# EasyEDA schematic SCH_Vertical-Carousel_2025-01-21.json
TITLE: Vertical_Carousel; REV: 1.0; Date: 2025-01-17; Sheet: 1/1; Company: Fabtronics
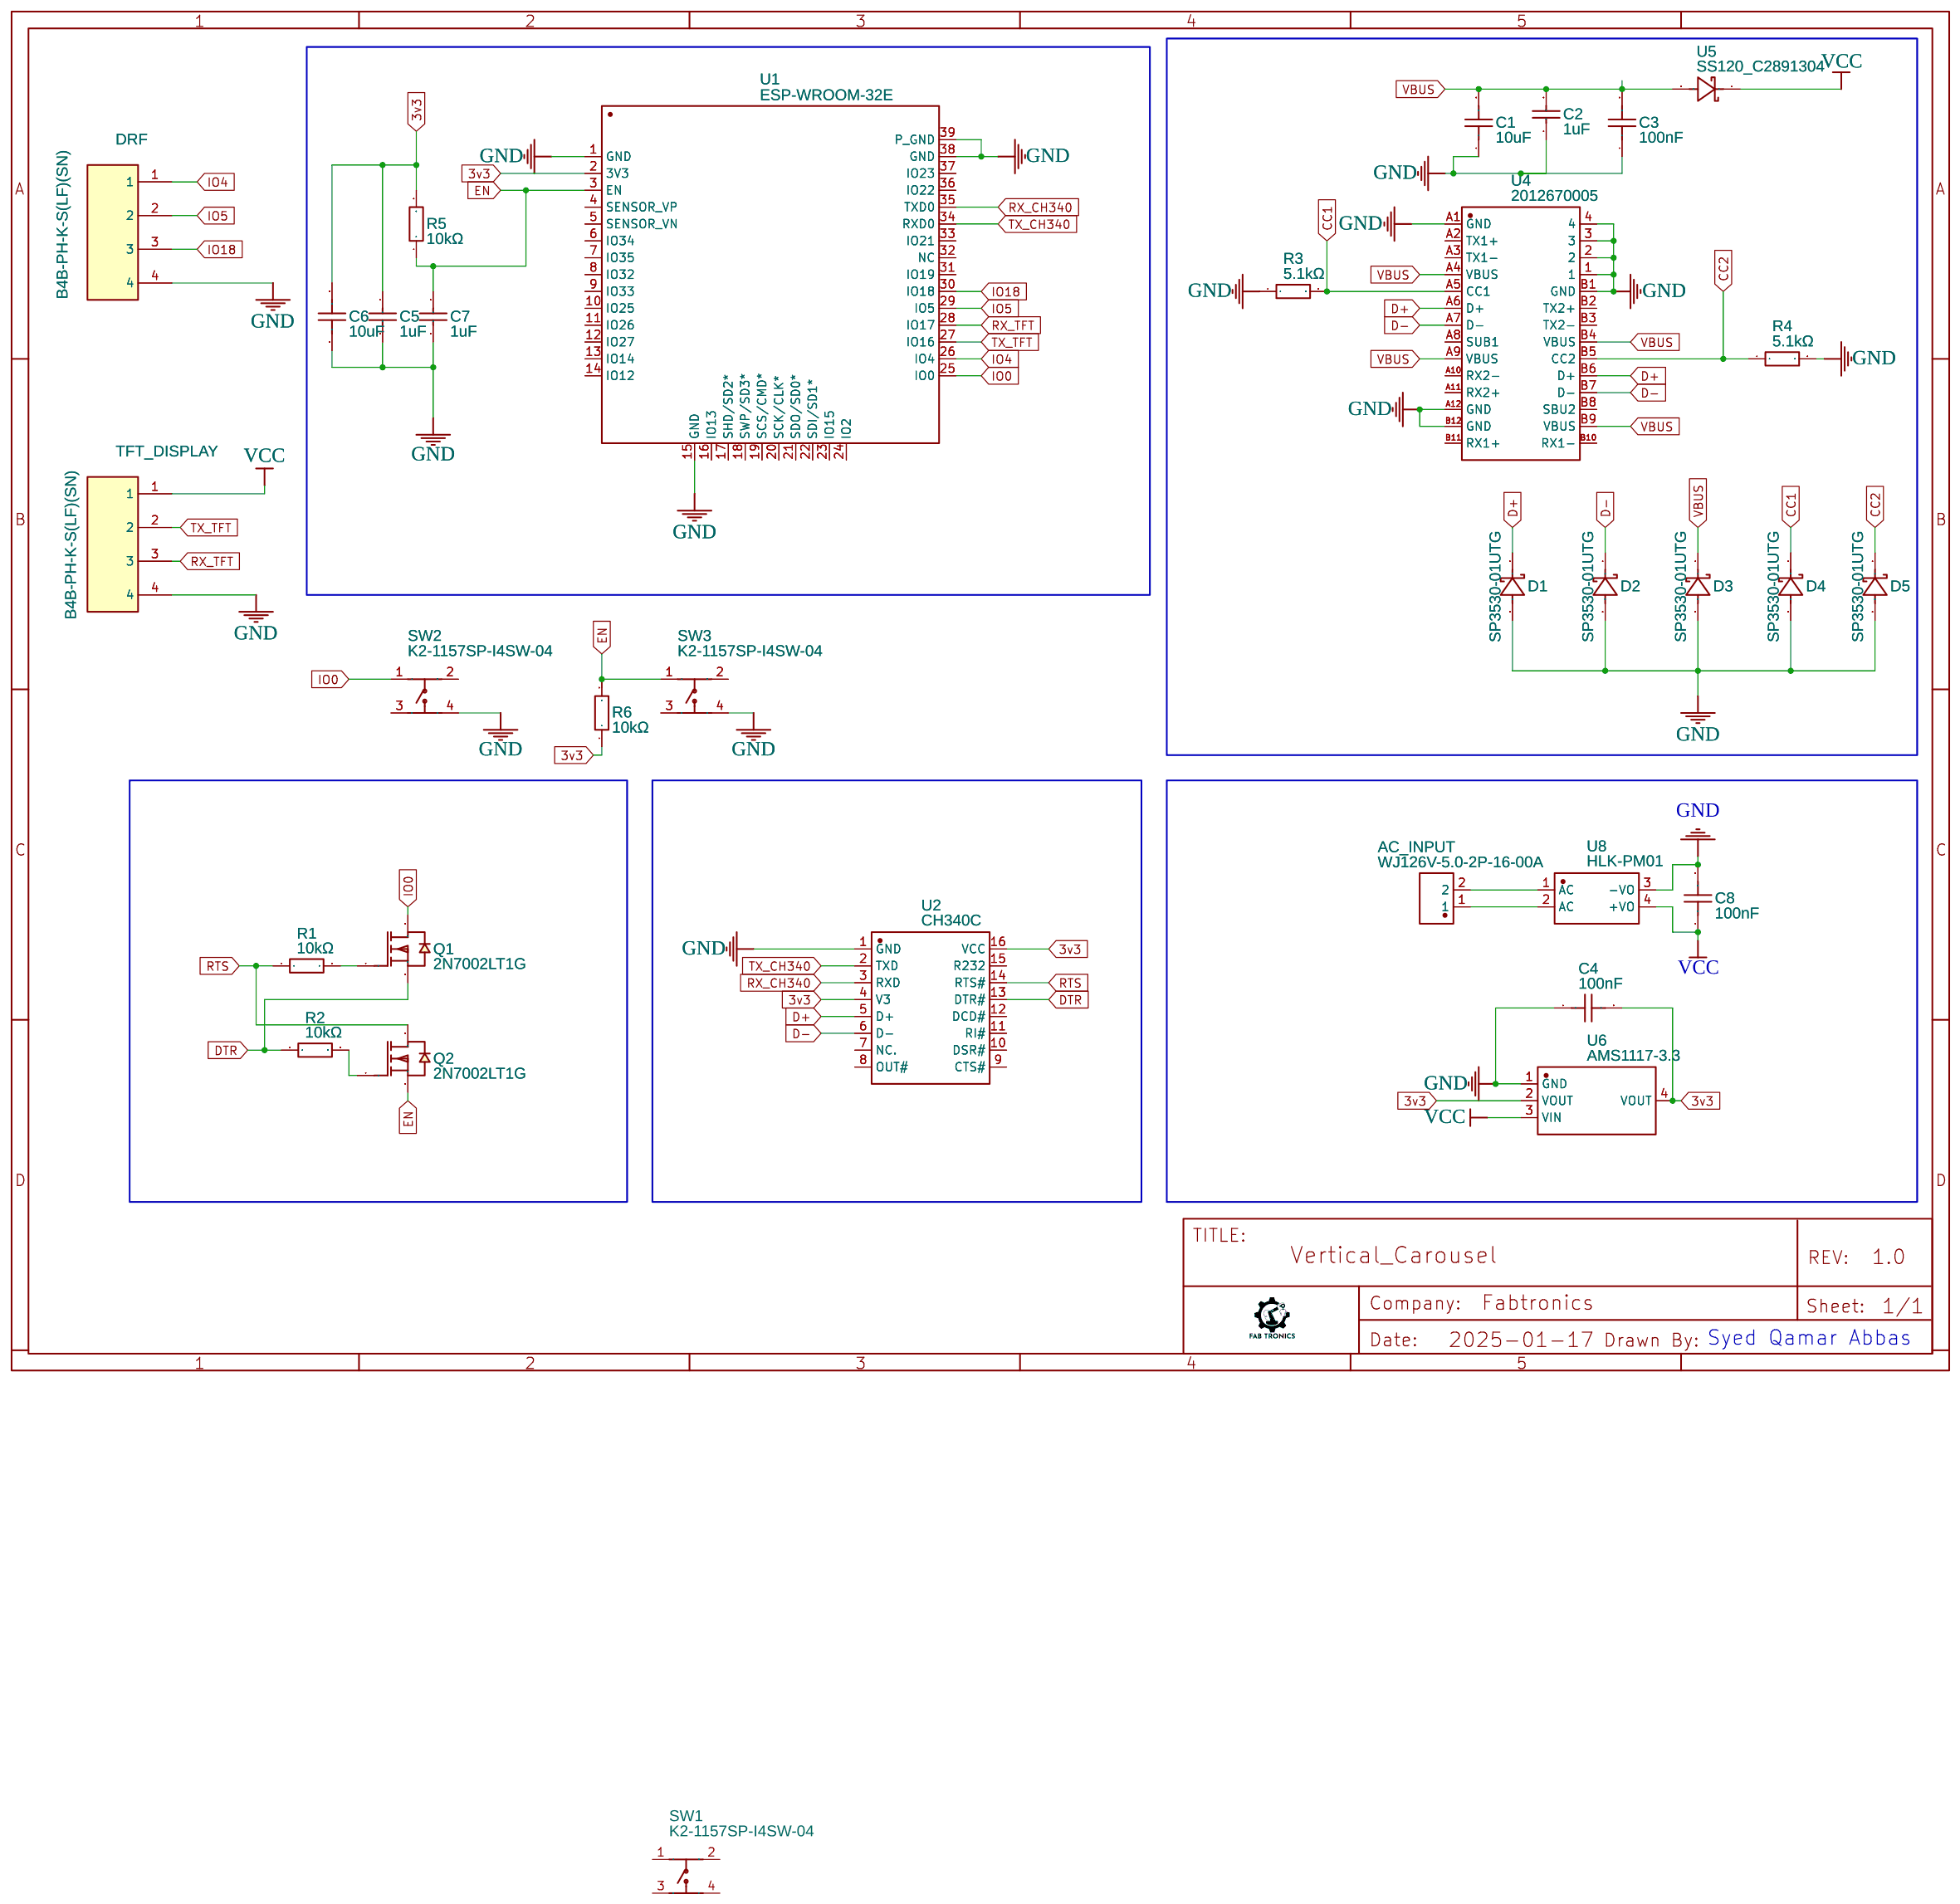
[diagram p0: schematic sheet]

## Parts
AC_INPUT  WJ126V-5.0-2P-16-00A  [CONN-TH_WJ126V-5.0-2P]
C1  10uF  [C0805]
C2  1uF  [C0805]
C3  100nF  [C0603]
C4  100nF  [C0603]
C5  1uF  [C0805]
C6  10uF  [C0805]
C7  1uF  [C0805]
C8  100nF  [C0603]
D1  SP3530-01UTG  [DFN0603-D_L0.6-W0.3-P0.34-RD]
D2  SP3530-01UTG  [DFN0603-D_L0.6-W0.3-P0.34-RD]
D3  SP3530-01UTG  [DFN0603-D_L0.6-W0.3-P0.34-RD]
D4  SP3530-01UTG  [DFN0603-D_L0.6-W0.3-P0.34-RD]
D5  SP3530-01UTG  [DFN0603-D_L0.6-W0.3-P0.34-RD]
DRF  B4B-PH-K-S(LF)(SN)  [CONN-TH_B4B-PH-K-S]
Q1  2N7002LT1G  [SOT-23_L2.9-W1.3-P1.90-LS2.4-BR]
Q2  2N7002LT1G  [SOT-23_L2.9-W1.3-P1.90-LS2.4-BR]
R1  10kΩ  [R0402]
R2  10kΩ  [R0402]
R3  5.1kΩ  [R0805]
R4  5.1kΩ  [R0805]
R5  10kΩ  [R0402]
R6  10kΩ  [R0402]
SW1  K2-1157SP-I4SW-04  [SW-SMD_4P-L6.2-W6.2-P4.50-LS8.6]
SW2  K2-1157SP-I4SW-04  [SW-SMD_4P-L6.2-W6.2-P4.50-LS8.6]
SW3  K2-1157SP-I4SW-04  [SW-SMD_4P-L6.2-W6.2-P4.50-LS8.6]
TFT_DISPLAY  B4B-PH-K-S(LF)(SN)  [CONN-TH_B4B-PH-K-S]
U1  ESP-WROOM-32E  [COMM-SMD_ESP-WROOM-32D]
U2  CH340C  [SOP-16_L10.0-W3.9-P1.27-LS6.0-BL]
U4  2012670005  [USB-C-SMD_2012670005]
U5  SS120_C2891304  [SMA_L4.5-W2.6-LS5.0-RD]
U6  AMS1117-3.3  [SOT-223-3_L6.5-W3.4-P2.30-LS7.0-BR]
U8  HLK-PM01  [PWRM-TH_HLK-PM01]

## Library data of the parts
AC_INPUT = WJ126V-5.0-2P-16-00A: Supplier: LCSC; Supplier Part: C3031437; Manufacturer: KANGNEX(康奈克斯电气); JLCPCB Part Class: Extended Part; Contributor: lcsc
C1 C6 = CL21A106KAYNNNE: Supplier: LCSC; Manufacturer: SAMSUNG(三星); Supplier Part: C15850; JLCPCB Part Class: Basic Part
C2 C5 C7 = CL21B105KBFNNNE: Supplier: LCSC; Manufacturer: SAMSUNG(三星); Supplier Part: C28323; JLCPCB Part Class: Basic Part
C3 C4 C8 = CC0603KRX7R9BB104: Supplier: LCSC; Manufacturer: YAGEO(国巨); Supplier Part: C14663; JLCPCB Part Class: Basic Part
D1-D5 = SP3530-01UTG: Contributor: LCSC; Supplier: LCSC; Supplier Part: C1973961; Manufacturer: Littelfuse(美国力特); JLCPCB Part Class: Extended Part
DRF TFT_DISPLAY = B4B-PH-K-S(LF)(SN): Contributor: LCSC; Supplier: LCSC; Manufacturer: JST; Supplier Part: C131334; JLCPCB Part Class: Extended Part
Q1 Q2 = 2N7002LT1G: Supplier: LCSC; Manufacturer: onsemi(安森美); Supplier Part: C16338; JLCPCB Part Class: Extended Part
R1 R2 R5 R6 = RC0402FR-0710KL: Supplier: LCSC; Manufacturer: YAGEO(国巨); Supplier Part: C60490; JLCPCB Part Class: Extended Part
R3 R4 = RS-05K512JT: Contributor: LCSC; Supplier: LCSC; Manufacturer: FH(风华); Supplier Part: C115337; JLCPCB Part Class: Extended Part
SW1-SW3 = K2-1157SP-I4SW-04: Contributor: LCSC; Supplier: LCSC; Supplier Part: C2909692; Manufacturer: 韩国韩荣; Manufacturer Part: K2-1157SP-I4SW-01; JLCPCB Part Class: Extended Part
U1 = ESP-WROOM-32E: Supplier: LCSC; Supplier Part: C19949066; Manufacturer: DOIT(四博智联); Contributor: lcsc; JLCPCB Part Class: Extended Part
U2 = CH340C: Supplier: LCSC; Manufacturer: WCH(南京沁恒); Supplier Part: C84681; JLCPCB Part Class: Extended Part
U4 = 2012670005: Contributor: LCSC; Supplier: LCSC; Supplier Part: C565324; Manufacturer: MOLEX; JLCPCB Part Class: Extended Part
U5 = SS120_C2891304: Contributor: lcsc; Supplier: LCSC; Supplier Part: C2891304; Manufacturer: GOODWORK(固得沃克); Manufacturer Part: SS120; JLCPCB Part Class: Extended Part
U6 = AMS1117-3.3: sourceId: dwIGgezVh; Supplier: LCSC; Manufacturer: AMS; Supplier Part: C6186; JLCPCB Part Class: Basic Part
U8 = HLK-PM01: Contributor: LCSC; Supplier: LCSC; Supplier Part: C209903; Manufacturer: HI-LINK(海凌科); JLCPCB Part Class: Extended Part

## Nets
3v3: C4.2 C5.2 C6.2 R5.2 R6.1 U1.2(3V3) U2.4(V3) U2.16(VCC) U6.2(VOUT) U6.4(VOUT)
GND: C1.1 C2.1 C3.1 C4.1 C5.1 C6.1 C7.1 C8.2 D1.2 D2.2 D3.2 D4.2 D5.2 DRF.4 R3.1 R4.2 SW2.4 SW3.4 TFT_DISPLAY.4 U1.1(GND) U1.15(GND) U1.38(GND) U1.39(P_GND) U2.1(GND) U4.1 U4.2 U4.3 U4.4 U4.A1(GND) U4.A12(GND) U4.B1(GND) U4.B12(GND) U6.1(GND) U8.3(-VO)
VBUS: C1.2 C2.2 C3.2 D3.1 U4.A4(VBUS) U4.A9(VBUS) U4.B4(VBUS) U4.B9(VBUS) U5.2(A)
VCC: C8.1 TFT_DISPLAY.1 U5.1(K) U6.3(VIN) U8.4(+VO)
CC1: D4.1 R3.2 U4.A5(CC1)
CC2: D5.1 R4.1 U4.B5(CC2)
D+: D1.1 U2.5(D+) U4.A6(D+) U4.B6(D+)
D-: D2.1 U2.6(D-) U4.A7(D-) U4.B7(D-)
DTR: Q1.2(S) R2.1 U2.13(DTR#)
EN: C7.2 Q2.2(S) R5.1 R6.2 SW3.1 U1.3(EN)
IO0: Q1.3(D) SW2.1 U1.25(IO0)
IO4: DRF.1 U1.26(IO4)
IO5: DRF.2 U1.29(IO5)
IO18: DRF.3 U1.30(IO18)
RTS: Q2.3(D) R1.1 U2.14(RTS#)
RX_CH340: U1.35(TXD0) U2.3(RXD)
RX_TFT: TFT_DISPLAY.3 U1.28(IO17)
TX_CH340: U1.34(RXD0) U2.2(TXD)
TX_TFT: TFT_DISPLAY.2 U1.27(IO16)
Net-(AC_INPUT-1): AC_INPUT.1 U8.2(AC)
Net-(AC_INPUT-2): AC_INPUT.2 U8.1(AC)
Net-(Q1-1): Q1.1(G) R1.2
Net-(Q2-1): Q2.1(G) R2.2

Not connected (* = marked no-connect by the designer): SW1 1 2 3 4; SW2 2 3; SW3 2 3; U1 4(SENSOR_VP) 5(SENSOR_VN) 6(IO34) 7(IO35) 8(IO32) 9(IO33) 10(IO25) 11(IO26) 12(IO27) 13(IO14) 14(IO12) 16(IO13) 17(SHD/SD2*) 18(SWP/SD3*) 19(SCS/CMD*) 20(SCK/CLK*) 21(SDO/SD0*) 22(SDI/SD1*) 23(IO15) 24(IO2) 31(IO19) 32(NC) 33(IO21) 36(IO22) 37(IO23); U2 7(NC.) 8(OUT#) 9(CTS#) 10(DSR#) 11(RI#) 12(DCD#) 15(R232); U4 A2(TX1+) A3(TX1-) A8(SUB1) A10(RX2-) A11(RX2+) B2(TX2+) B3(TX2-) B8(SBU2) B10(RX1-) B11(RX1+)

## Notes on the sheet
- Syed Qamar Abbas
